# EAGLE design usb-to-serial (EAGLE 9.6.2)
AUTHOR: Adam Horcica; TITLE: USB to COM convertor; VERSION: 1.0
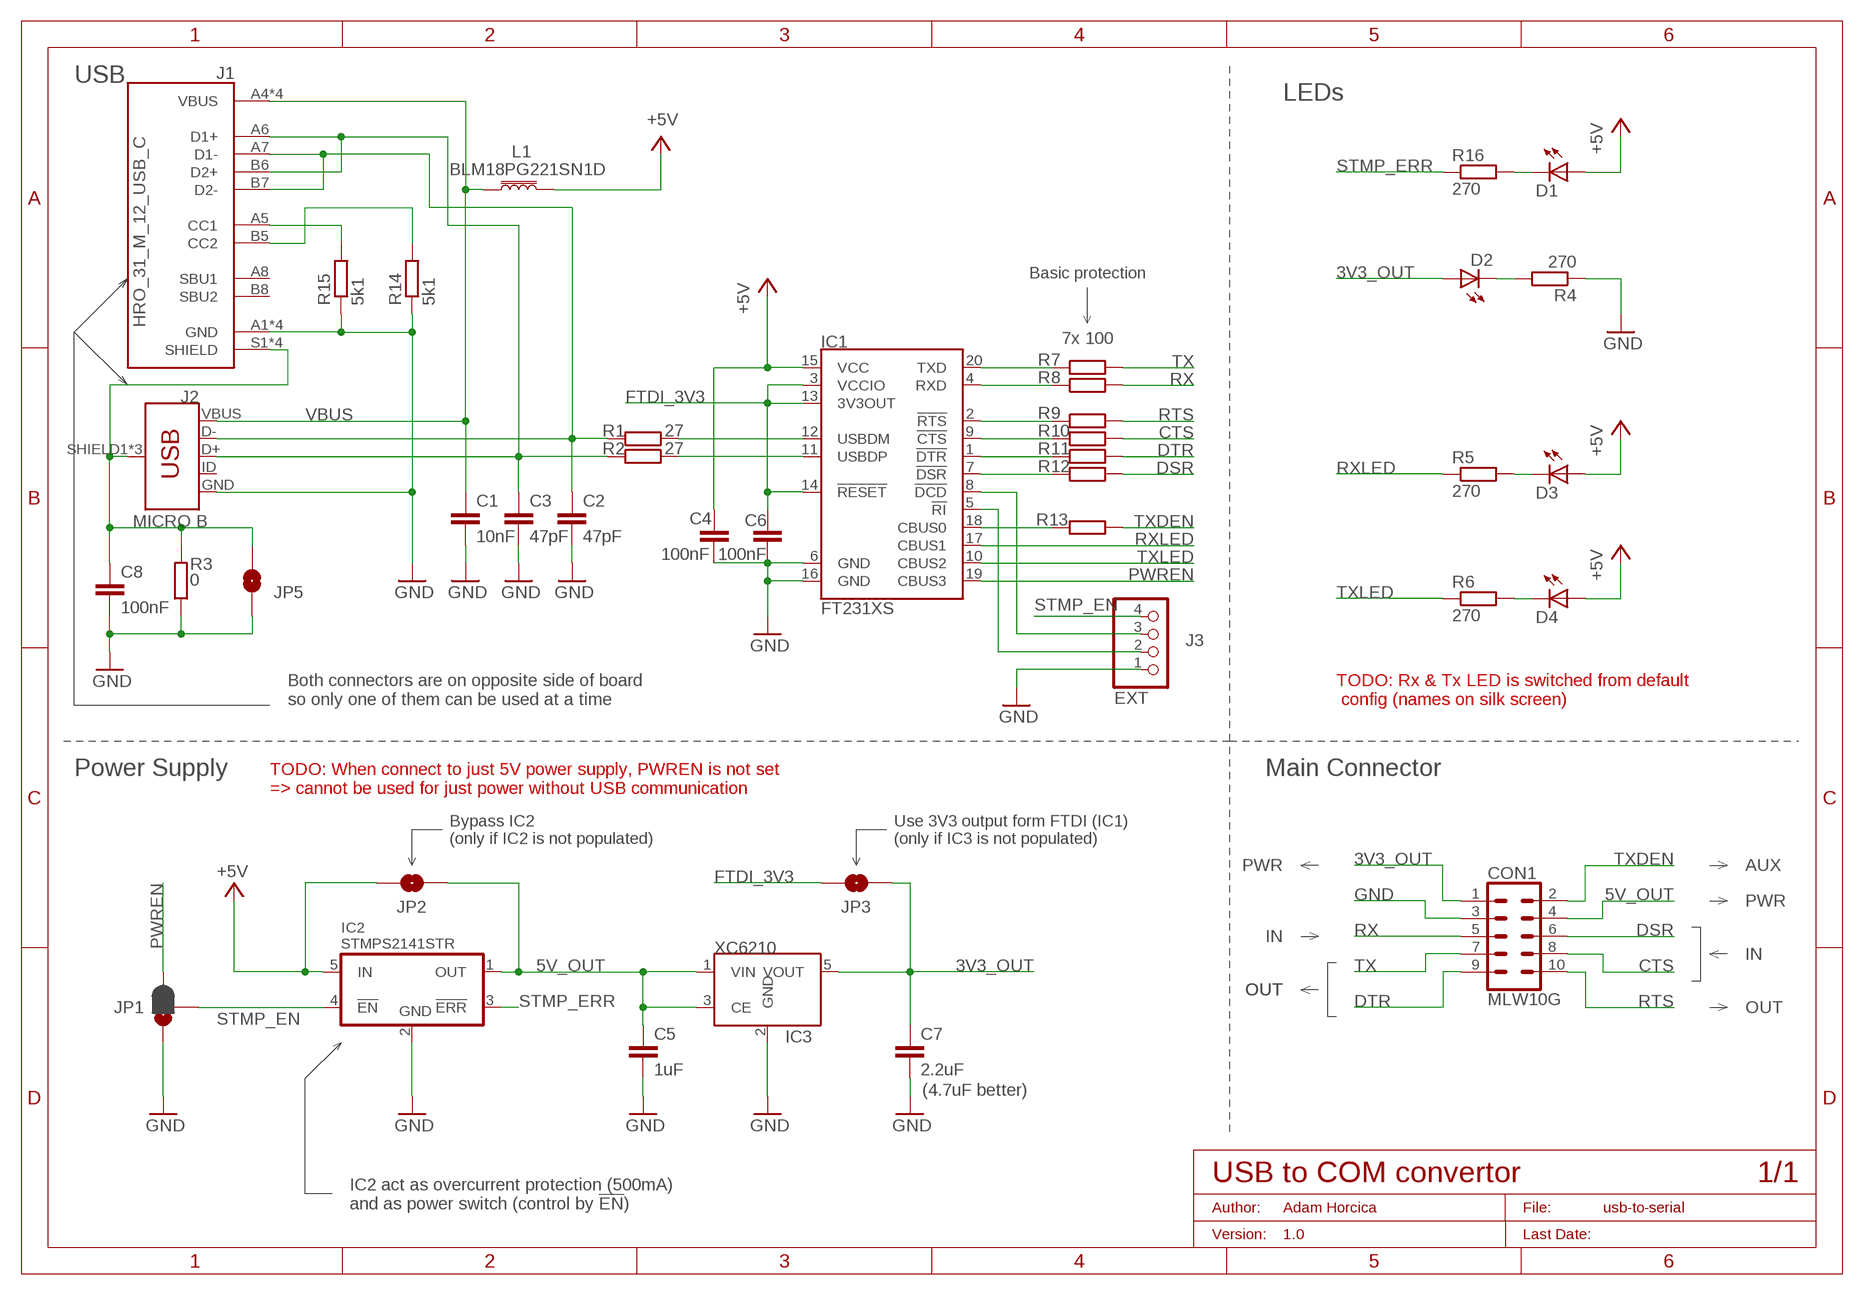
[diagram p0: schematic, sheet 1]

## Parts
C1  10nF  C-EUC0603  [C0603]
C2  47pF  C-EUC0603  [C0603]
C3  47pF  C-EUC0603  [C0603]
C4  100nF  C-EUC0603  [C0603]
C5  1uF  C-EUC0603  [C0603]
C6  100nF  C-EUC0603  [C0603]
C7  2.2uF  C-EUC0603  [C0603]
C8  100nF  C-EUC0603  [C0603]
CON1  MLW10G  [MLW10G]
D1  LEDCHIP-LED0805  [CHIP-LED0805]
D2  LEDCHIP-LED0805  [CHIP-LED0805]
D3  LEDCHIP-LED0805  [CHIP-LED0805]
D4  LEDCHIP-LED0805  [CHIP-LED0805]
EXT  J3  PINHD-1X4  [1X04]
IC1  FT231XS  [SSOP20_L]
IC2  STMPS2141STR  [SOT23-5]
IC3  XC6210  [SOT-23-5]
J1  HRO_31_M_12_USB_C  [HRO_31_M_12_USB_C]
J2  MICRO B  USB_MICRO-B_FEMALE-SMT  [USB-B-MICRO-SMD]
JP1  JUMPER-SMT_3_1-NC_PASTE_NO-SILK  [SMT-JUMPER_3_1-NC_PASTE_NO-SILK]
JP2  JUMPER-SMT_2_NO_NO-SILK  [SMT-JUMPER_2_NO_NO-SILK]
JP3  JUMPER-SMT_2_NO_NO-SILK  [SMT-JUMPER_2_NO_NO-SILK]
JP5  JUMPER-SMT_2_NO_NO-SILK  [SMT-JUMPER_2_NO_NO-SILK]
L1  BLM18PG221SN1D  FERRITE_BEAD-0603  [0603]
R1  27  R-EU_R0603  [R0603]
R2  27  R-EU_R0603  [R0603]
R3  0  R-EU_R0603  [R0603]
R4  270  R-EU_R0603  [R0603]
R5  270  R-EU_R0603  [R0603]
R6  270  R-EU_R0603  [R0603]
R7  100  R-EU_R0603  [R0603]
R8  100  R-EU_R0603  [R0603]
R9  100  R-EU_R0603  [R0603]
R10  100  R-EU_R0603  [R0603]
R11  100  R-EU_R0603  [R0603]
R12  100  R-EU_R0603  [R0603]
R13  100  R-EU_R0603  [R0603]
R14  5k1  R-EU_R0603  [R0603]
R15  5k1  R-EU_R0603  [R0603]
R16  270  R-EU_R0603  [R0603]

## Nets
3V3_OUT: C7.1 CON1.1 D2.A IC3.5(VOUT) JP3.2
5V_OUT: C5.1 CON1.4 IC2.1(OUT) IC3.1(VIN) IC3.3(CE) JP2.2
+5V: C4.1 D1.A D3.A D4.A IC1.15(VCC) IC2.5(IN) JP2.1 L1.1
CTS: CON1.8 R10.2
DCD: EXT.3 IC1.8(!DCD)
DSR: CON1.6 R12.2
DTR: CON1.9 R11.2
FTDI_3V3: C6.1 IC1.3(VCCIO) IC1.13(3V3OUT) IC1.14(!RESET) JP3.1
GND: C1.2 C2.2 C3.2 C4.2 C5.2 C6.2 C7.2 C8.2 CON1.3 EXT.1 IC1.6(GND) IC1.16(GND) IC2.2(GND) IC3.2(GND) J1.A1(GND) J1.A12(GND) J1.B1(GND) J1.B12(GND) J2.GND JP1.1 JP5.1 R3.1 R4.1 R14.1 R15.1
N$1: IC1.18(CBUS0) R13.1
N$2: J1.A5(CC1) R15.2
N$3: IC1.20(TXD) R7.1
N$5: D2.C R4.2
N$7: J1.B5(CC2) R14.2
N$8: C8.1 J1.S1(SHIELD) J1.S2(SHIELD) J1.S3(SHIELD) J1.S4(SHIELD) J2.SHIELD1(SHIELD) J2.SHIELD2(SHIELD) J2.SHIELD3(SHIELD) JP5.2 R3.2
N$9: D3.C R5.2
N$10: D4.C R6.2
N$11: D1.C R16.2
N$13: IC1.4(RXD) R8.1
N$14: IC1.2(!RTS) R9.1
N$15: IC1.9(!CTS) R10.1
N$16: IC1.1(!DTR) R11.1
N$17: IC1.7(!DSR) R12.1
PWREN: IC1.19(CBUS3) JP1.3
RI: EXT.2 IC1.5(!RI)
RTS: CON1.10 R9.2
RX: CON1.5 R8.2
RXLED: IC1.17(CBUS1) R5.1
STMP_EN: EXT.4 IC2.4(!EN) JP1.2
STMP_ERR: IC2.3(!ERR) R16.1
TX: CON1.7 R7.2
TXDEN: CON1.2 R13.2
TXLED: IC1.10(CBUS2) R6.1
USBD2_N: IC1.12(USBDM) R1.2
USBD2_P: IC1.11(USBDP) R2.2
USBD_N: C2.1 J1.A7(D1-) J1.B7(D2-) J2.D- R1.1
USBD_P: C3.1 J1.A6(D1+) J1.B6(D2+) J2.D+ R2.1
VBUS: C1.1 J1.A4(VBUS) J1.A9(VBUS) J1.B4(VBUS) J1.B9(VBUS) J2.VBUS L1.2
Unconnected: J1.A8(SBU1) J1.B8(SBU2) J2.ID

## Notes on the sheet
- USB
- LEDs
- Basic protection
- 7x 100
- Both connectors are on opposite side of board 
  so only one of them can be used at a time
- TODO: Rx & Tx LED is switched from default
   config (names on silk screen)
- Power Supply | Main Connector
- TODO: When connect to just 5V power supply, PWREN is not set
  => cannot be used for just power without USB communication
- Bypass IC2
  (only if IC2 is not populated)
- Use 3V3 output form FTDI (IC1)
  (only if IC3 is not populated)
- PWR | AUX
- PWR
- IN
- IN
- OUT | OUT
- OUT
- (4.7uF better)
- IC2 act as overcurrent protection (500mA)
  and as power switch (control by !EN!)

## Library data of the parts
C1-C8 = rcl:C-EU: CAPACITOR, European symbol; SPICEPREFIX: C
CON1 = connectors:MLW10G: Connector "Konektor pro ploché kabely do DPS přímý, rozteč 2,54mm, 2x5 kontaktů." from GME.cz; OC_GME: 800-035; URL: https://www.gme.cz/konektor-mlw10g
D1-D4 = led:LED: LED OSRAM: - CHIPLED LG R971, LG N971, LY N971, LG Q971, LY Q971, LO R971, LY R971 LH N974, LH R974 LS Q976, LO Q976, LY Q976 LO Q996 - Hyper CHIPLED LW Q18S LB Q993, LB Q99A, LB R99A - SideLED LS A670, LO A670, LY A670, LG A670, LP A670 LB A673, LV A673, LT A673, LW A673 LH A674 LY A675 LS A676, LA A676, LO A676, LY A676, LW A676 LS A679, LY A679, LG A679 - Hyper Micro SIDELED® LS Y876, LA Y876, LO Y876, LY Y876 LT Y87S - SmartLED LW L88C, LW L88S LB L89C, LB L89S, LG L890 LS L89K, LO L89K, LY L89K LS L896, LA L896, LO L896, LY L896 - TOPLED LS T670, LO T670, LY T670, LG T670, LP T670 LSG T670, LSP T670, LSY T670, LOP T670, LYG T670 LG T671, LOG T671, LSG T671 LB T673, LV T673, LT T673, LW T673 LH T674 LS T676, LA T676, LO T676, LY T676, LB T676, LH T676, LSB T676, LW T676 LB T67C, LV T67C, LT T67C, LS T67K, LO T67K, LY T67K, LW E67C LS E67B, LA E67B, LO E67B, LY E67B, LB E67C, LV E67C, LT E67C LW T67C LS T679, LY T679, LG T679 LS T770, LO T770, LY T770, LG T770, LP T770 LB T773, LV T773, LT T773, LW T773 LH T774 LS E675, LA E675, LY E675, LS T675 LS T776, LA T776, LO T776, LY T776, LB T776 LHGB T686 LT T68C, LB T68C - Hyper Mini TOPLED® LB M676 - Mini TOPLED Santana® LG M470 LS M47K, LO M47K, LY M47K Source: http://www.osram.convergy.de LUXEON: - LUMILED® LXK2-PW12-R00, LXK2-PW12-S00, LXK2-PW14-U00, LXK2-PW14-V00 LXK2-PM12-R00, LXK2-PM12-S00, LXK2-PM14-U00 LXK2-PE12-Q00, LXK2-PE12-R00, LXK2-PE12-S00, LXK2-PE14-T00, LXK2-PE14-U00 LXK2-PB12-K00, LXK2-PB12-L00, LXK2-PB12-M00, LXK2-PB14-N00, LXK2-PB14-P00, LXK2-PB14-Q00 LXK2-PR12-L00, LXK2-PR12-M00, LXK2-PR14-Q00, LXK2-PR14-R00 LXK2-PD12-Q00, LXK2-PD12-R00, LXK2-PD12-S00 LXK2-PH12-R00, LXK2-PH12-S00 LXK2-PL12-P00, LXK2-PL12-Q00, LXK2-PL12-R00 Source: www.luxeon.com KINGBRIGHT: KA-3528ASYC Source: www.kingbright.com
EXT = pinhead:PINHD-1X4: PIN HEADER
IC1 = SparkFun-IC-Comms:FT231X: FTDI FT231X Full Speed USB to Full-handshake UART This USB2.0 Full Speed IC offers a compact bridge to full handshake UART interfaces. The device is a UART, capable of operating up to 3MBaud, with low power consumption (8mA). The FT231X includes the complete FT-X series feature set and enables USB to be added into a system design quickly and easily over a UART interface. Datasheet <http://cdn.sparkfun.com/datasheets/Components/General%20IC/DS_FT231X.pdf> SparkFun Products SparkFun RedBoard - Programmed with Arduino <https://www.sparkfun.com/products/12757> (DEV-12757) SparkFun XBee Explorer USB <https://www.sparkfun.com/products/11812> (WRL-11812) SparkFun XBee Explorer Dongle <https://www.sparkfun.com/products/11697> (WRL-11697) SparkFun Blynk Board - ESP8266 <https://www.sparkfun.com/products/13794> (WRL-13794) SparkFun ESP8266 Thing - Dev Board <https://www.sparkfun.com/products/13711> (WRL-13711) SparkFun Block for Intel® Edison - Base <https://www.sparkfun.com/products/13045> (DEV-13045) SparkFun RedStick <https://www.sparkfun.com/products/13741> (DEV-13741) SparkFun Beefy 3 - FTDI Basic Breakout <https://www.sparkfun.com/products/13746> (DEV-13746) SparkFun FT231X Breakout <https://www.sparkfun.com/products/11736> (BOB-11736); PROD_ID: IC-11524
IC2 = ic-power:STMPS2141
IC3 = Bastlir:XC6210
J1 = Bastlir:HRO_31_M_12_USB_C: USB Shielded I/O Receptacle; Type C; Right Angle; Surface Mount; Gold over Nickel
J2 = SparkFun-Connectors:USB_MICRO-B: USB Type Micro-B Connector Male/female and PTH/SMT variants SparkFun Products: SparkFun microB USB Breakout <https://www.sparkfun.com/products/12035> SparkFun USB microB Plug Breakout <https://www.sparkfun.com/products/10031> SparkFun ESP8266 Thing <https://www.sparkfun.com/products/13231>; PROD_ID: CONN-11752
JP1 = SparkFun-Jumpers:JUMPER-SMT_3_1-NC_PASTE: Normally closed solder jumper (1 of 2 connections) This jumper has an aperture in the stencil to allow solder paste to bridge one of the two connections. One connection is normally closed (NC), while the other is normally open (NO). Wick off the solder to open the connection. Reapply solder to reclose the connection. Apply solder to the other side instead to change the current path.
JP2 JP3 JP5 = SparkFun-Jumpers:JUMPER-SMT_2_NO: Normally open jumper This jumper has two pads in close proximity to each other. Apply solder to close the connection. Round pads are easier to solder for beginners, but are a lot larger. SparkFun Product that uses the round pads: SparkFun EL Sequencer <https://www.sparkfun.com/products/12781>
L1 = SparkFun-Coils:FERRITE_BEAD: Ferrite Bead (blocks, cores, rings, chokes, etc.) Inductor with layers of ferrite used to suppress high frequencies. Often used to isolate high frequency noise. SparkFun Products: IOIO-OTG - V2.2 <https://www.sparkfun.com/products/13613> SparkFun SAMD21 Mini Breakout <https://www.sparkfun.com/products/13664> SparkFun 6 Degrees of Freedom Breakout - LSM6DS3 <https://www.sparkfun.com/products/13339> SparkFun SAMD21 Dev Breakout <https://www.sparkfun.com/products/13672>; OC_FARNELL: 1515740; ON_FARNELL: BLM18PG221SN1D; PROD_ID: NDUC-07859; VALUE: 30Ω/1.8A
R1-R16 = rcl:R-EU_: RESISTOR, European symbol; SPICEPREFIX: R

## Board
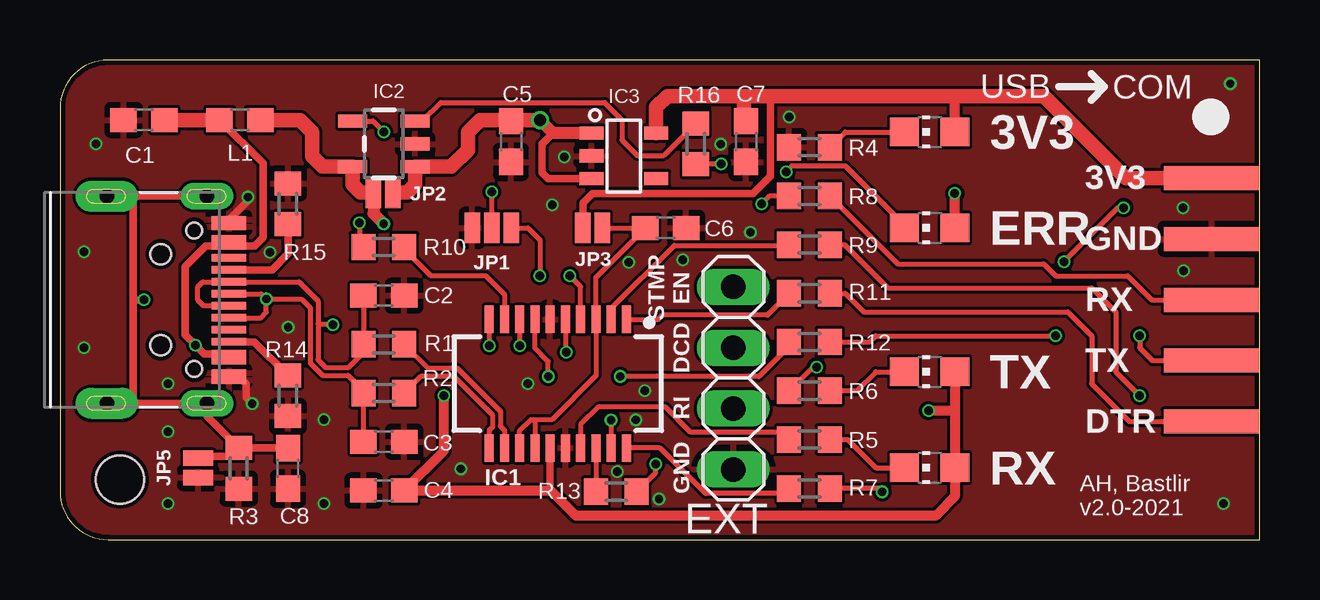
[diagram p1: board, top side]
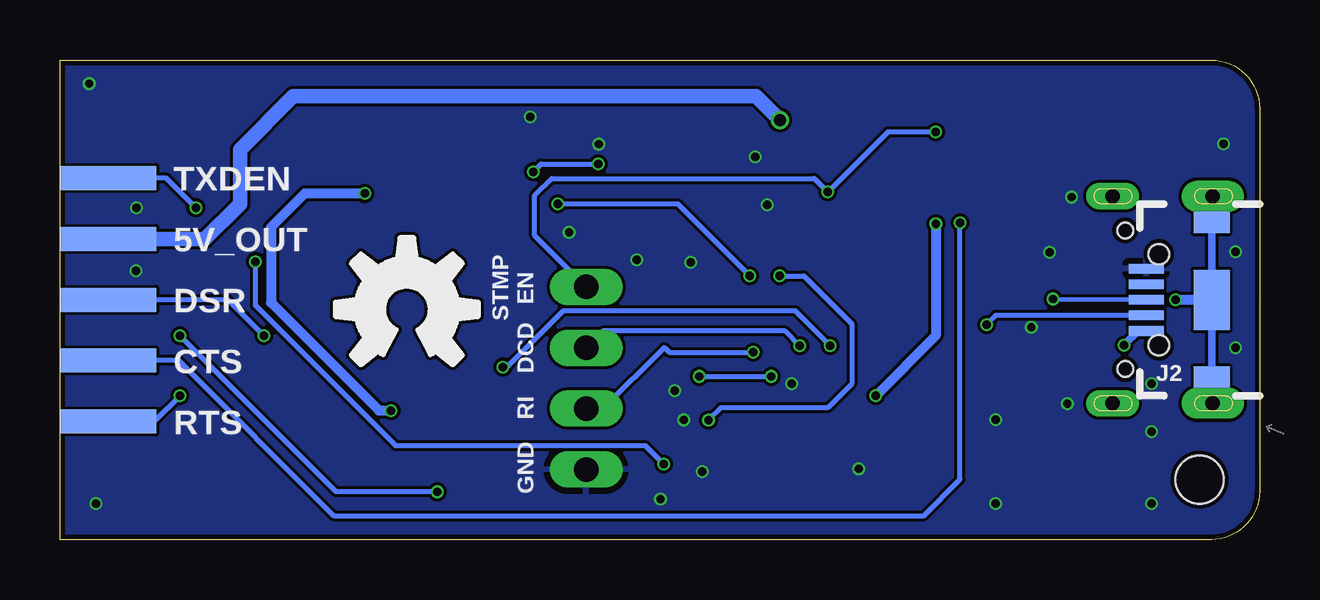
[diagram p2: board, bottom side, seen from below]

Size 50 x 20 mm. Coordinates in mm from the lower left corner, seen from the top.
Outline: 50,20 2,19.99 arc90 0,17.99 0,2 arc90 2,0 50,0 50,20
Copper layers (1*16): Top 0.035559375mm / dielectric 1.6mm / Bottom 0.035559375mm
Design rules "jlcpcb2layer": minimum track width 5mil, minimum drill 12mil, track to track 5mil, track to pad 5mil, pad to pad 5mil, via to via 5mil, smd to smd 5mil, copper to edge 8mil, drill to drill 6mil, minimum pad ring 5mil, minimum via ring 3mil, stop-mask expansion 2.5mil, vias tented up to drill 0mil, thermal gap 10mil
Holes 2 mm at 2.5,2.5

### Footprints (pad centres in the part's own frame; a part is rotated, then mirrored left to right if it is on the bottom)
C0603 = smd 1.1 x 1: 1 -0.85,0; 2 0.85,0
MLW10G = smd 4 x 1: 1 -2,5.08; 3 -2,2.54; 5 -2,0; 7 -2,-2.54; 9 -2,-5.08 | smd 4 x 1 bottom: 2 -2,5.08; 4 -2,2.54; 6 -2,0; 8 -2,-2.54; 10 -2,-5.08
CHIP-LED0805 = smd 1.2 x 1.2: A 0,-1.05; C 0,1.05
1X04 = drill 1.016 long: 1 -3.81,0; 2 -1.27,0; 3 1.27,0; 4 3.81,0
SSOP20_L = smd 0.381 x 1.143: 1 -2.857,-2.68; 2 -2.223,-2.68; 3 -1.587,-2.68; 4 -0.953,-2.68; 5 -0.318,-2.68; 6 0.318,-2.68; 7 0.953,-2.68; 8 1.587,-2.68; 9 2.223,-2.68; 10 2.857,-2.68; 11 2.857,2.68; 12 2.223,2.68; 13 1.587,2.68; 14 0.953,2.68; 15 0.318,2.68; 16 -0.318,2.68; 17 -0.953,2.68; 18 -1.587,2.68; 19 -2.223,2.68; 20 -2.857,2.68
SOT23-5 = smd 0.55 x 1.2: 1 -0.95,-1.3; 2 0,-1.3; 3 0.95,-1.3; 4 0.95,1.3; 5 -0.95,1.3
SOT-23-5 = smd 1 x 0.55: 1 -1.35,0.95; 2 -1.35,0; 3 -1.35,-0.95; 4 1.35,-0.95; 5 1.35,0.95
HRO_31_M_12_USB_C = smd 0.3 x 1.45: A1 -3.35,4.045; A4 -2.55,4.045; A5 -1.25,4.045; A6 -0.25,4.045; A7 0.25,4.045; A8 1.25,4.045; A9 2.55,4.045; A12 3.35,4.045; B1 3.05,4.045; B4 2.25,4.045; B5 1.75,4.045; B6 0.75,4.045; B7 -0.75,4.045; B8 -1.75,4.045; B9 -2.25,4.045; B12 -3.05,4.045 | drill 0.6 pad 1.1 long: S1 -4.32,3.13; S2 4.32,3.13 | drill 0.6 pad 1.3 long: S3 -4.32,-1.05; S4 4.32,-1.05 | hole 0.65: -2.89,2.6; 2.89,2.6
USB-B-MICRO-SMD = smd 1.45 x 0.4: D+ 2.725,0; D- 2.725,0.65; GND 2.725,-1.3; ID 2.725,-0.65; VBUS 2.725,1.3 | smd 1.5 x 1.8: SHIELD1 0,3.685; SHIELD2 0,-3.685 | smd 1.5 x 2.5: SHIELD3 0,0 | hole 0.85: 2.2,1.9; 2.2,-1.9
SMT-JUMPER_3_1-NC_PASTE_NO-SILK = smd 0.635 x 1.27: 1 -0.813,0; 2 0,0; 3 0.813,0
SMT-JUMPER_2_NO_NO-SILK = smd 0.635 x 1.27: 1 -0.406,0; 2 0.406,0
0603 = smd 1.1 x 1: 1 -0.85,0; 2 0.85,0
R0603 = smd 1 x 1.1: 1 -0.85,0; 2 0.85,0

### Placement (x,y rotation side)
C1  3.5,17.5 180 top
C2  13.5,10.17 0 top
C3  13.5,4.08 0 top
C4  13.5,2.05 180 top
C5  18.8,16.6 270 top
C6  25.25,13 0 top
C7  28.6,16.6 270 top
C8  9.5,2.97 270 top
CON1  50,10 0 top
D1  36.25,13 90 top
D2  36.25,17 90 top
D3  36.25,3 90 top
D4  36.25,7 90 top
EXT  28.07,6.73 90 top
IC1  20.75,6.5 180 top
IC2  13.5,16.5 90 top
IC3  23.5,16 0 top
J1  3,10 270 top
J2  2,10 180 bottom
JP1  18,13 0 top
JP2  13.47,14.46 0 top
JP3  22.2,13 180 top
JP5  5.76,2.99 90 top
L1  7.5,17.5 180 top
R1  13.5,8.14 0 top
R2  13.5,6.11 0 top
R3  7.45,2.97 90 top
R4  31.24,16.36 0 top
R5  31.24,4.17 0 top
R6  31.24,6.21 0 top
R7  31.24,2.13 0 top
R8  31.24,14.33 0 top
R9  31.24,12.3 0 top
R10  13.5,12.2 180 top
R11  31.24,10.27 0 top
R12  31.24,8.24 0 top
R13  23.19,2 0 top
R14  9.5,6 90 top
R15  9.5,14 270 top
R16  26.5,16.5 270 top

### Tracks (layer width: path | path; a pad name or v marks a point on that pad's centre or on a via)
3V3_OUT
  Top 0.2: 35.2,18.3 35,18.5
  Top 0.305: JP3.2 21.79,14.02 22.19,14.42 28.88,14.42 29.61,15.15 29.61,18.5
  Top 0.406: D2.A 37.3,18.47 37.27,18.5
  Top 0.61: CON1.1 44.42,15.08 41,18.5 37.27,18.5 35,18.5 29.61,18.5 28.5,18.5 | IC3.5 24.85,18.03 25.32,18.5 28.5,18.5 | C7.1 28.5,17.55 28.5,18.5
5V_OUT  (via drill 0.5)
  Top 0.2: C5.1 18.85,17.5 19,17.5
  Top 0.305: IC3.3 20.35,15.05 20.1,15.3 20.1,16.5 20.55,16.95
  Top 0.508: IC3.1 20.55,16.95 v20,17.5
  Top 0.61: v20,17.5 19,17.5 17.5,17.5 17,17 17,16.25 16.3,15.55 IC2.1 14.8,14.79 14.47,14.46 JP2.2
  Bottom 0.61: CON1.4 43.96,12.54 42.5,14 42.5,16.27 40.28,18.49 20.99,18.49 v20,17.5
+5V  (via drill 0.35)
  Top 0.2: 20.45,2.05 20.43,2.07
  Top 0.305: 20.43,2.07 IC1.15
  Top 0.406: v16,6 16,3.7 C4.1 20.45,2.05 21.5,1 36.5,1 37.3,1.8 D3.A 37.3,5.37 | D1.A v37.3,14.43 | D4.A 37.3,5.37 | v36.2,5.38 37.29,5.38 37.3,5.37
  Top 0.508: JP2.1 13.06,13.6 v13.49,13.17
  Top 0.61: L1.1 10,17.5 10.5,17 10.5,16 10.95,15.55 IC2.5 12.2,14.79 12.53,14.46 JP2.1
  Bottom 0.406: v16,6 13.49,8.51 v13.49,13.17 | v37.3,14.43 39.8,14.43 41.2,13.03 41.2,9.88 36.7,5.38 v36.2,5.38
CTS  (via drill 0.35)
  Top 0.2: v12.48,13.21 12.48,12.37 R10.2
  Bottom 0.2: v12.48,13.21 12.48,2.52 14,1 38.6,1 45.06,7.46 CON1.8
DCD  (via drill 0.35)
  Top 0.2: IC1.8 v19.16,8.08
  Bottom 0.2: v19.16,8.08 19.77,8.69
  Bottom 0.203: 19.77,8.69 27.38,8.69 EXT.3
DSR  (via drill 0.35)
  Top 0.2: R12.2 33.74,8.24 34,8.5 v41.5,8.5
  Bottom 0.2: v41.5,8.5 43,10 CON1.6
DTR
  Top 0.2: R11.2 32.73,10.27 33.5,9.5 42,9.5 43,8.5 43,6.5 44.58,4.92 CON1.9
FTDI_3V3
  Top 0.2: IC1.13 19.16,4.54 19.62,5 19.75,5 | IC1.14 19.8,4.95 19.75,5 | 19.75,5 20.5,5 22.34,6.84 IC1.3 22.34,10.94 C6.1 JP3.1
GND  (via drill 0.35)
  Top 0.305: J1.A12 J1.B1 7.3,6.95 7.75,6.5 7.75,5.93 v8.01,5.67 | J1.B12 J1.A1 7.84,14.14 v7.84,14.28
  other vias: 1,12 1,8 1.5,16.5 4.5,4.5 11,5 48.78,19.01 48.5,1.5 28.78,12.81 16.71,2.95 11,1.5 24.37,6.21 19.5,6.5 4.5,1.5 21.02,15.96 27.55,16.49 30.4,17.62 4.5,6.5 46.83,11.21 46.81,13.83 9.51,8.86 8.75,11.98 25.96,11.66 24,4.99 23.23,2.83 24.97,1.69 20.52,13.96 23.7,11.57
  pour Top: -1,23 -1,-3 51.25,-3 51.25,23
  pour Bottom: -3,22 53,22 53,-2 -3,-2
N$1
  Top 0.2: IC1.18 R13.1
N$2
  Top 0.305: J1.A5 8.84,11.25 9.51,11.92 R15.2
N$3
  Top 0.2: R7.1 30.39,1.95 30.36,1.92 26.91,1.92 25.01,3.82 IC1.20
N$4
  Bottom 0.2: 34.56,7.71 arc-7 34.35,7.84 33.63,7.29 33.22,7.69 33.78,8.41 arc-23 33.45,9.19 32.55,9.31 32.55,9.89 33.45,10.01 arc-23 33.78,10.79 33.22,11.51 33.63,11.91 34.35,11.36 arc-23 35.13,11.69 35.25,12.59 35.83,12.59 35.95,11.69 arc-23 36.73,11.36 37.45,11.91 37.86,11.51 37.31,10.79 arc-23 37.63,10.01 38.53,9.89 38.53,9.31 37.63,9.19 arc-23 37.31,8.41 37.86,7.69 37.45,7.29 36.73,7.84 arc-7 36.52,7.71 35.99,8.74 arc62 36.51,9.6 arc242 35.09,8.74 34.56,7.71
N$5
  Top 0.2: R4.2 32.73,17 D2.C
N$7
  Top 0.305: J1.B5 8.1,8.25 R14.2
N$8  (via drill 0.35)
  Top 0.305: C8.1 R3.2 | JP5.2 5.83,3.47 6.97,3.47 7.32,3.82 R3.2 | R3.2 6.13,5.14 J1.S2 3.05,5.68 | 3.05,5.68 J1.S4 | J1.S1 3.05,14.32 | 3.05,14.32 J1.S3 | 3.05,14.32 3.05,10 | 3.05,10 3.05,5.68 | v3.5,10 3.05,10
  Bottom 0.305: J2.SHIELD2 J2.SHIELD3 J2.SHIELD1
  Bottom 0.406: J2.SHIELD3 v3.5,10
N$9
  Top 0.2: R5.2 32.83,4.17 34,3 D3.C
N$10
  Top 0.2: R6.2 33.21,6.21 34,7 D4.C
N$11  (via drill 0.35)
  Top 0.2: D1.C 35.2,13.11 32.73,15.58 30.51,15.58 v30.27,15.34 | v27.57,15.66 R16.2
  Bottom 0.2: v30.27,15.34 29.95,15.66 v27.57,15.66
N$13  (via drill 0.35)
  Top 0.2: IC1.4 21.7,10.55 v21.25,11 | R8.1 29.58,14.33 v29.25,14
  Bottom 0.2: v21.25,11 24.25,14 v29.25,14
N$14
  Top 0.2: IC1.2 22.97,9.63 25.61,12.27 30.36,12.27 R9.1
N$15
  Top 0.2: IC1.9 18.53,10.22 17.75,11 15.47,11 14.35,12.12 R10.1
N$16
  Top 0.2: IC1.1 24.93,9.18 25.11,9.36 29.48,9.36 R11.1
N$17  (via drill 0.35)
  Top 0.2: v20.35,6.8 20.35,7.43 19.8,7.98 IC1.7 | R12.1 30.39,8.06 29.13,6.8 v23.36,6.8
  Bottom 0.2: v23.36,6.8 v20.35,6.8
PWREN  (via drill 0.35)
  Top 0.2: JP1.3 19.5,13 20,12.5 v20,11 | v22.97,4.98 v22.97,4.97 IC1.19
  Bottom 0.2: v20,11 19,11 17,9 17,6.5 18,5.5 22.45,5.5 v22.97,4.98
RI  (via drill 0.35)
  Top 0.2: IC1.5 21.07,7.85 v21.11,7.81
  Bottom 0.2: 24.79,8 24.6,7.81 v21.11,7.81
  Bottom 0.203: 24.79,8 24.83,8 27.37,5.46 EXT.2
RTS  (via drill 0.35)
  Top 0.2: R9.2 32.7,12.3 34.5,10.5 43,10.5 44,9.5 44,7 v45,6
  Bottom 0.2: v45,6 46.08,4.92 CON1.10
RX
  Top 0.2: R8.2 34.92,11.5 41,11.5 41.5,11 44.5,11 45.5,10
  Top 0.203: 45.5,10 CON1.5
RXLED
  Top 0.2: R5.1 30.09,4.47 26.29,4.47 25.23,5.53 22.44,5.53 21.7,4.79 IC1.17
STMP_EN  (via drill 0.35)
  Top 0.2: IC2.4 13.05,17.45 v13.5,17
  Top 0.203: JP1.2 v18,14.5
  Bottom 0.2: v13.5,17 15.5,17 v18,14.5
  Bottom 0.203: EXT.4 30.21,12.68 30.21,14.36 29.51,15.06 18.56,15.06 v18,14.5
STMP_ERR
  Top 0.2: IC2.3 15.1,17.45 15.88,18.23 22.7,18.23 23.43,17.5 23.43,16.66 24.07,16.02 25.17,16.02 R16.1
TX  (via drill 0.35)
  Top 0.2: v34.27,1.99 34.13,2.13 R7.2 | v45,8.5 45,8 45.54,7.46 CON1.7
  Bottom 0.2: v34.27,1.99 38.49,1.99 v45,8.5
TXDEN  (via drill 0.35)
  Top 0.2: v44.34,13.84 44.1,13.84 v41.85,11.59 | R13.2 24.83,2.79 v24.83,3.14
  Bottom 0.2: v24.83,3.14 25.6,3.91 36,3.91 41.85,9.76 v41.85,11.59 | v44.34,13.84 45.58,15.08 CON1.2
TXLED  (via drill 0.35)
  Top 0.2: IC1.10 v17.89,8.08 | R6.1 31.38,7.2 v31.53,7.2
  Bottom 0.2: v17.89,8.08 19.35,9.54 29.03,9.54 31.37,7.2 v31.53,7.2
USBD2_N
  Top 0.2: R1.2 15.34,7.15 16.56,7.15 18.36,5.35 18.36,4.72 18.53,4.55 IC1.12
USBD2_P
  Top 0.2: R2.2 15.06,6.82 16.41,6.82 18.03,5.2 18.03,4.69 17.89,4.55 IC1.11
USBD_N  (via drill 0.35)
  Top 0.15: 10.8,8.96 10.76,9 | 12.65,7.8 R1.1
  Top 0.2: v11.38,8.96 10.8,8.96 | 12.65,7.8 12.03,7.18 11.07,7.18 10.76,7.49 10.76,9 10.76,9.95 9.96,10.75 J1.B7 5.95,10.75 5.74,10.54 5.74,9.99 5.98,9.75 J1.A7 | C2.1 R1.1
  Bottom 0.2: J2.D- 10.99,9.35 v11.38,8.96
USBD_P  (via drill 0.35)
  Top 0.15: 12.65,6.2 R2.1
  Top 0.2: 12.65,6.2 12,6.85 10.94,6.85 10.43,7.36 10.43,9.67 10.07,10.03 v8.6,10.03 | C3.1 R2.1 | J1.A6 8.38,10.25 v8.6,10.03 | J1.B6 8.38,9.25 8.6,9.47 v8.6,10.03
  Bottom 0.15: J2.D+
  Bottom 0.2: v8.6,10.03 J2.D+
VBUS  (via drill 0.35)
  Top 0.305: J1.A9 J1.B4 6.01,7.75 v5.65,8.11 5.22,8.54 5.22,11.39 6.08,12.25 J1.B9 | J1.A4 J1.B9 | J1.B9 8.11,12.25 8.46,12.6 8.46,15.69 L1.2
  Top 0.61: L1.2 C1.1
  Bottom 0.305: J2.VBUS 5.06,8.7 v5.65,8.11

### Text on the board
tNames: USB | COM | 3V3 | ERR | STMP / EN | 3V3 / / GND / / RX / / TX / / DTR | DCD | TX | RI | GND | RX | AH, Bastlir | v2.0-2021
bNames: STMP / EN | TXDEN / / 5V_OUT / / DSR / / CTS / / RTS | DCD | RI | GND